# EAGLE design Winter_v2 (EAGLE 9.2.0)

## Sheet 1 of 4
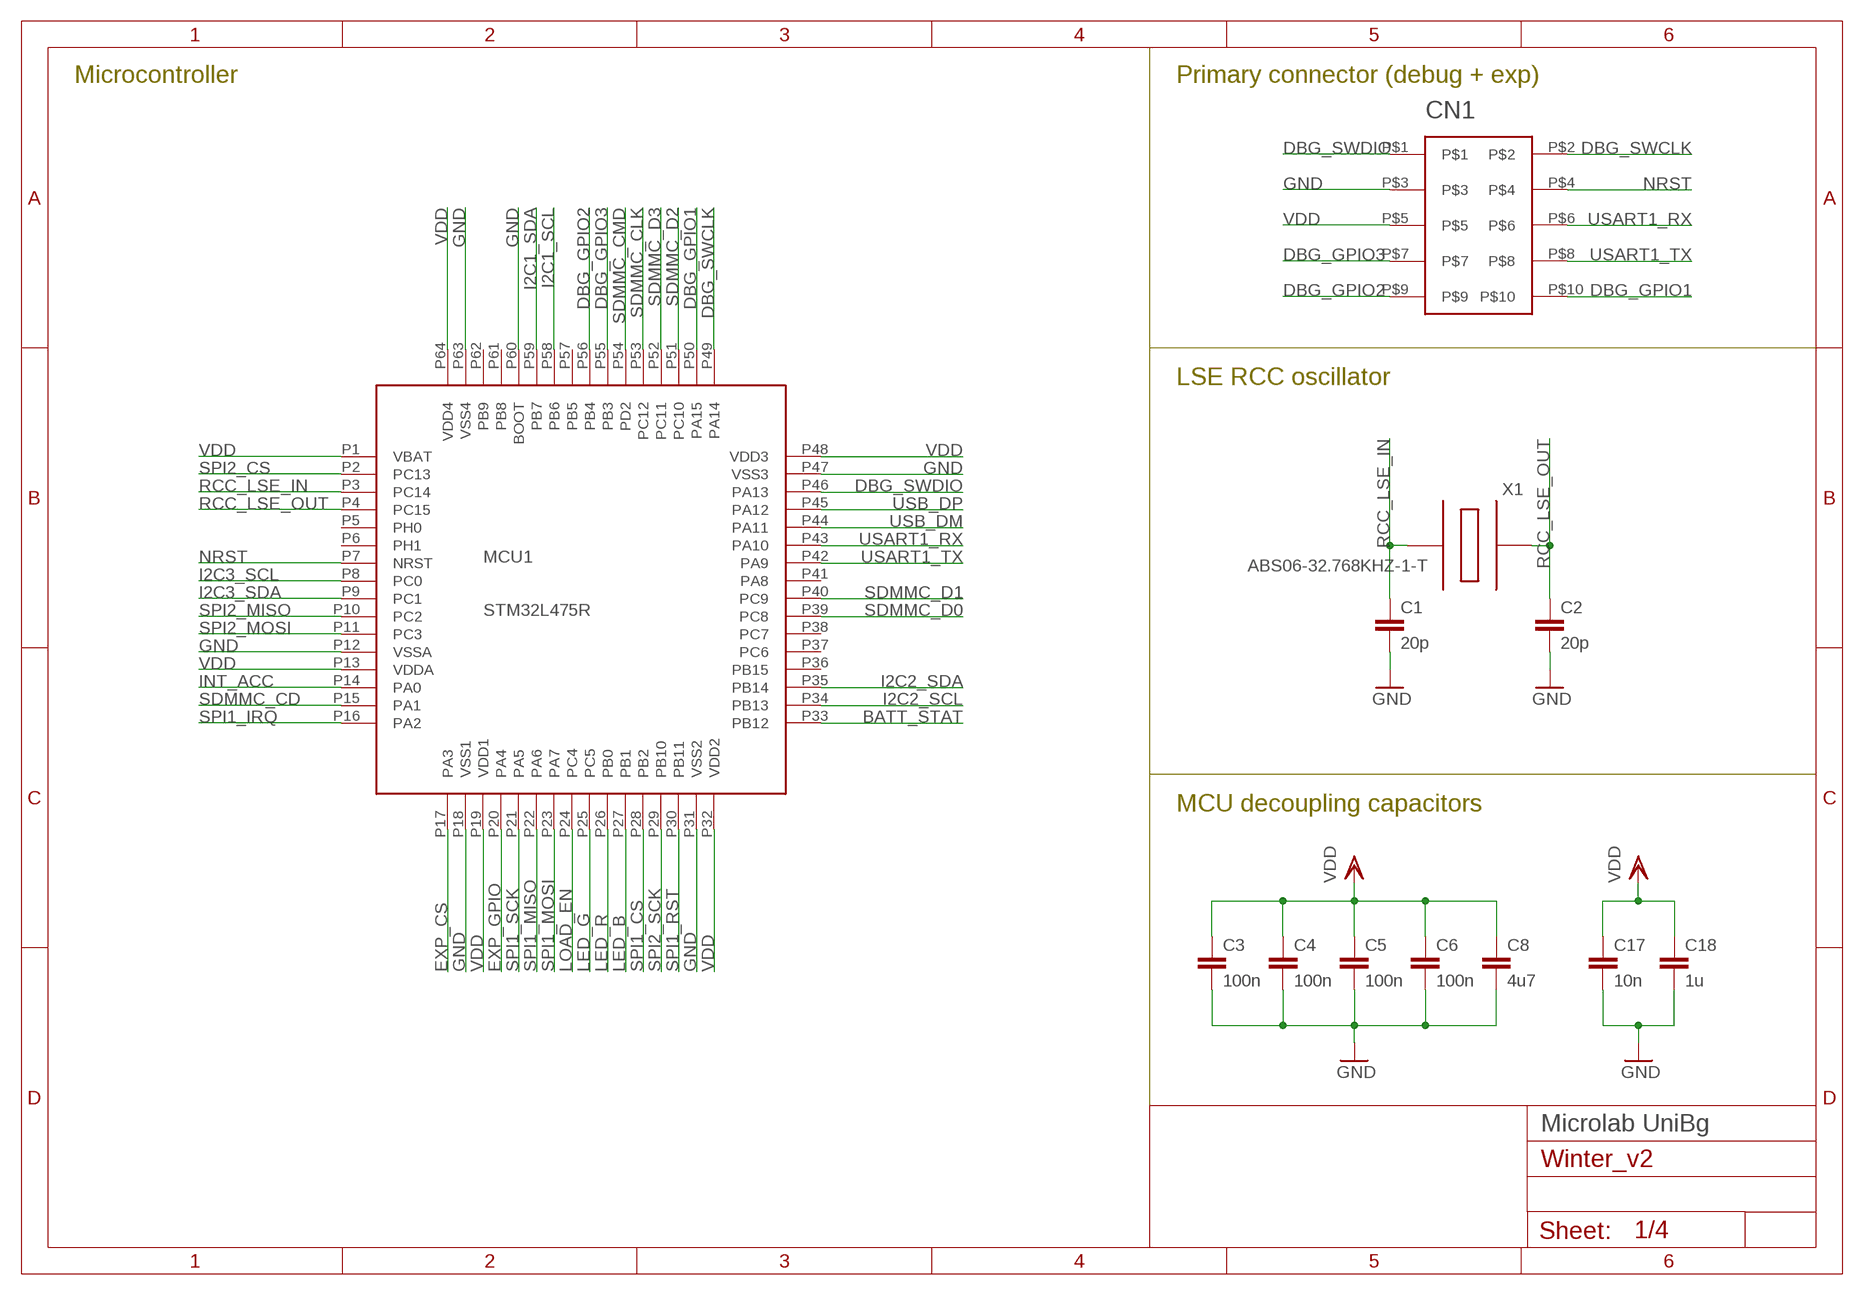
[diagram p0: schematic, sheet 1]

### Parts
C1  20p  C0402  [C0402]
C2  20p  C0402  [C0402]
C3  100n  C0402  [C0402]
C4  100n  C0402  [C0402]
C5  100n  C0402  [C0402]
C6  100n  C0402  [C0402]
C8  4u7  C0402  [C0402]
C17  10n  C0402  [C0402]
C18  1u  C0402  [C0402]
CN1  FTSH-105TO  [FTSH-105-XX]
MCU1  STM32L475R  [LQFP64]
X1  ABS06-32.768KHZ-1-T  [ABS06]

### Nets
BATT_STAT: MCU1.P33(PB12) ; also sheet 2
DBG_GPIO1: CN1.P$10 MCU1.P50(PA15)
DBG_GPIO2: CN1.P$9 MCU1.P56(PB4)
DBG_GPIO3: CN1.P$7 MCU1.P55(PB3)
DBG_SWCLK: CN1.P$2 MCU1.P49(PA14)
DBG_SWDIO: CN1.P$1 MCU1.P46(PA13)
EXP_CS: MCU1.P17(PA3) ; also sheet 4
EXP_GPIO: MCU1.P20(PA4) ; also sheet 4
GND: C1.P$2 C2.P$2 C3.P$2 C4.P$2 C5.P$2 C6.P$2 C8.P$2 C17.P$2 C18.P$2 CN1.P$3 MCU1.P12(VSSA) MCU1.P18(VSS1) MCU1.P31(VSS2) MCU1.P47(VSS3) MCU1.P60(BOOT) MCU1.P63(VSS4) ; also sheet 2,3,4
I2C1_SCL: MCU1.P58(PB6) ; also sheet 3
I2C1_SDA: MCU1.P59(PB7) ; also sheet 3
I2C2_SCL: MCU1.P34(PB13) ; also sheet 2
I2C2_SDA: MCU1.P35(PB14) ; also sheet 2
I2C3_SCL: MCU1.P8(PC0) ; also sheet 4
I2C3_SDA: MCU1.P9(PC1) ; also sheet 4
INT_ACC: MCU1.P14(PA0) ; also sheet 3
LED_B: MCU1.P27(PB1) ; also sheet 2
LED_G: MCU1.P25(PC5) ; also sheet 2
LED_R: MCU1.P26(PB0) ; also sheet 2
LOAD_EN: MCU1.P24(PC4) ; also sheet 2
NRST: CN1.P$4 MCU1.P7(NRST)
RCC_LSE_IN: C1.P$1 MCU1.P3(PC14) X1.P1
RCC_LSE_OUT: C2.P$1 MCU1.P4(PC15) X1.P2
SDMMC_CD: MCU1.P15(PA1) ; also sheet 4
SDMMC_CLK: MCU1.P53(PC12) ; also sheet 4
SDMMC_CMD: MCU1.P54(PD2) ; also sheet 4
SDMMC_D0: MCU1.P39(PC8) ; also sheet 4
SDMMC_D1: MCU1.P40(PC9) ; also sheet 4
SDMMC_D2: MCU1.P51(PC10) ; also sheet 4
SDMMC_D3: MCU1.P52(PC11) ; also sheet 4
SPI1_CS: MCU1.P28(PB2) ; also sheet 4
SPI1_IRQ: MCU1.P16(PA2) ; also sheet 4
SPI1_MISO: MCU1.P22(PA6) ; also sheet 4
SPI1_MOSI: MCU1.P23(PA7) ; also sheet 4
SPI1_RST: MCU1.P30(PB11) ; also sheet 4
SPI1_SCK: MCU1.P21(PA5) ; also sheet 4
SPI2_CS: MCU1.P2(PC13) ; also sheet 3
SPI2_MISO: MCU1.P10(PC2) ; also sheet 3,4
SPI2_MOSI: MCU1.P11(PC3) ; also sheet 3,4
SPI2_SCK: MCU1.P29(PB10) ; also sheet 3,4
USART1_RX: CN1.P$6 MCU1.P43(PA10)
USART1_TX: CN1.P$8 MCU1.P42(PA9)
USB_DM: MCU1.P44(PA11) ; also sheet 4
USB_DP: MCU1.P45(PA12) ; also sheet 4
VDD: C3.P$1 C4.P$1 C5.P$1 C6.P$1 C8.P$1 C17.P$1 C18.P$1 CN1.P$5 MCU1.P1(VBAT) MCU1.P13(VDDA) MCU1.P19(VDD1) MCU1.P32(VDD2) MCU1.P48(VDD3) MCU1.P64(VDD4) ; also sheet 2,3,4
Unconnected: MCU1.P5(PH0) MCU1.P6(PH1) MCU1.P36(PB15) MCU1.P37(PC6) MCU1.P38(PC7) MCU1.P41(PA8) MCU1.P57(PB5) MCU1.P61(PB8) MCU1.P62(PB9)

### Notes on the sheet
- Microcontroller | Primary connector (debug + exp)
- LSE RCC oscillator
- MCU decoupling capacitors
- Microlab UniBg

## Sheet 2 of 4
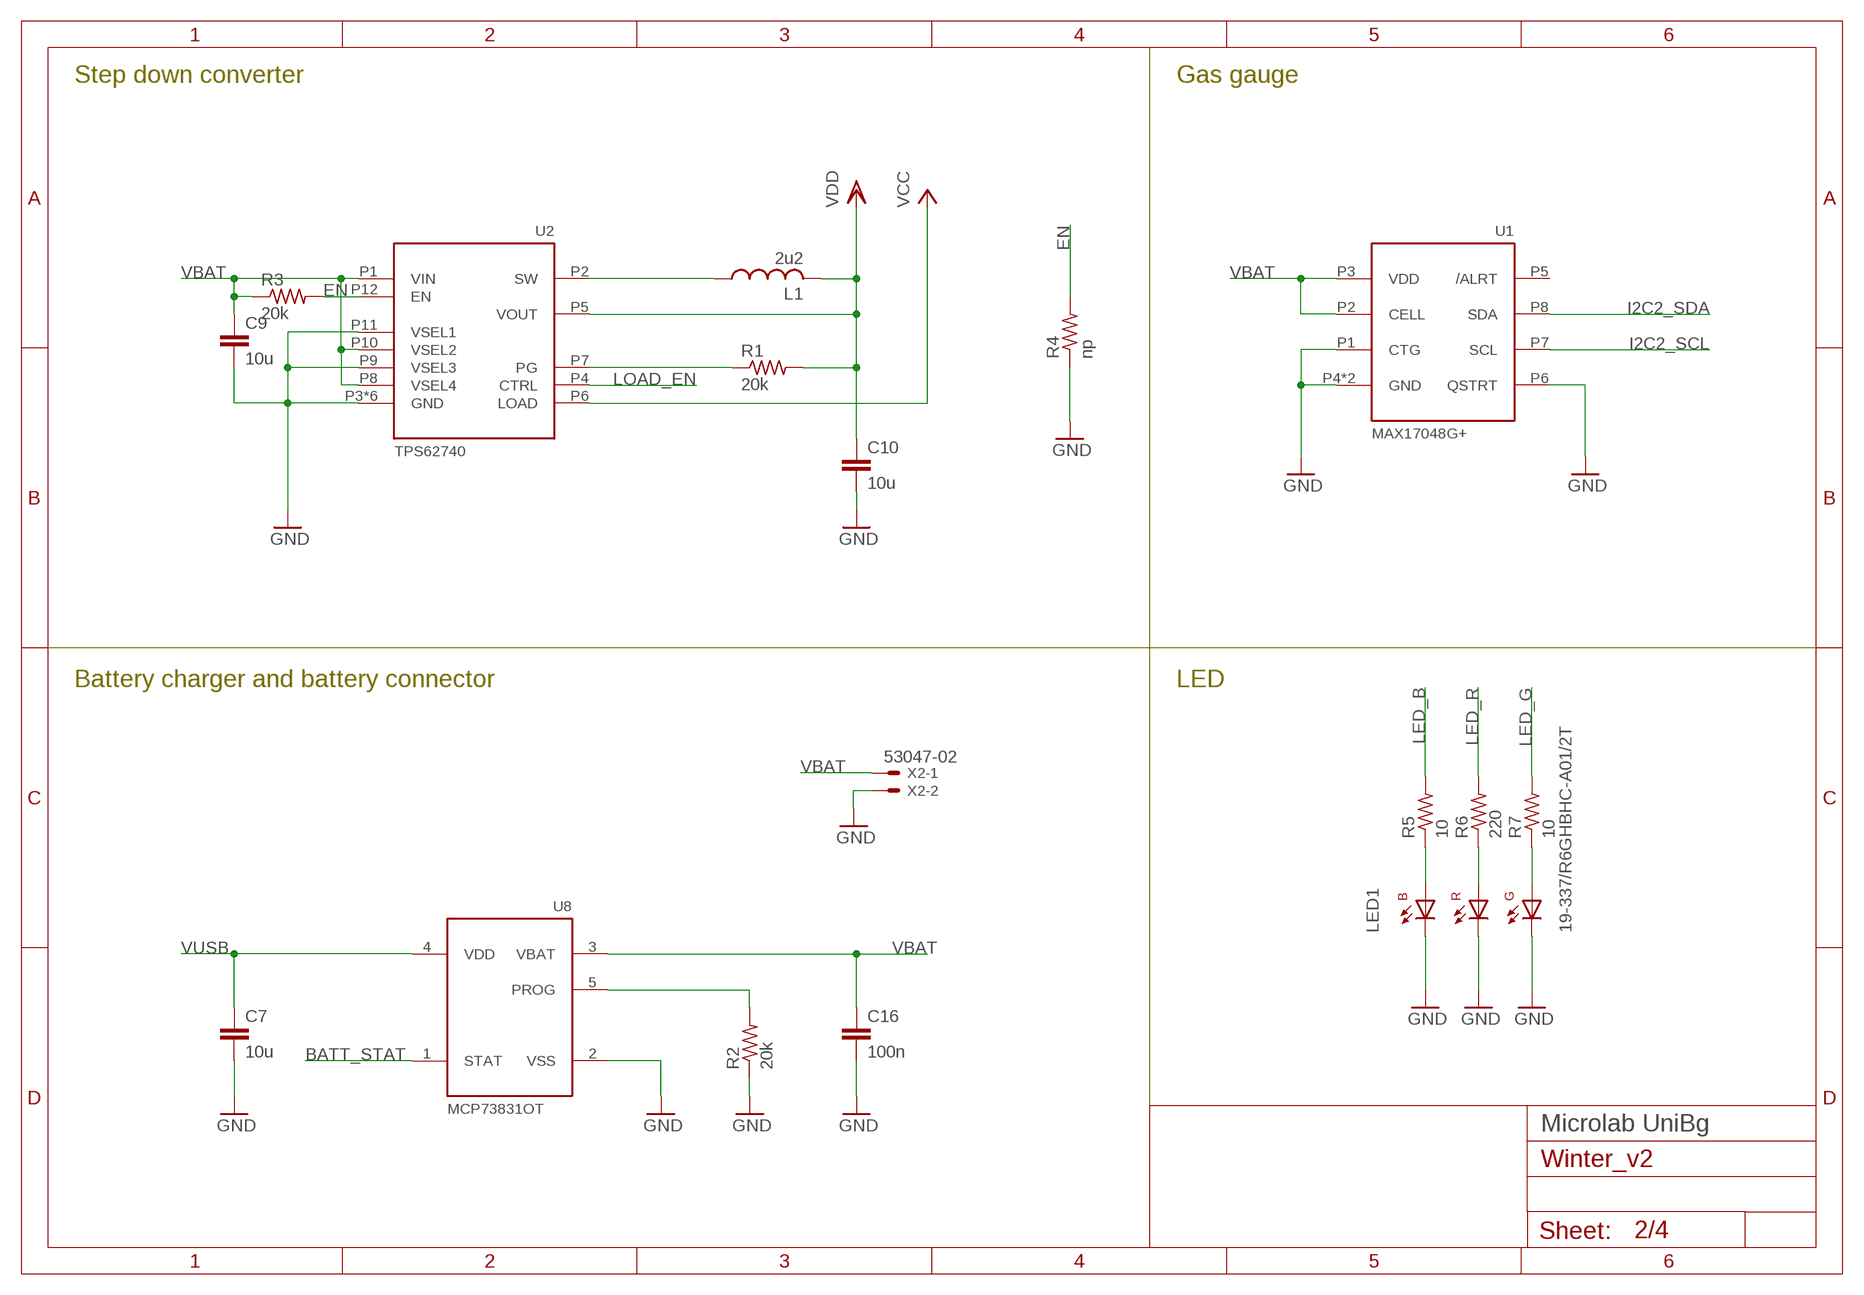
[diagram p1: schematic, sheet 2]

### Parts
C7  10u  C0603  [C0603]
C9  10u  C0603  [C0603]
C10  10u  C0603  [C0603]
C16  100n  C0402  [C0402]
L1  2u2  74479276222C74479276222C  [C01005]
LED1  19-337/R6GHBHC-A01/2T  [19-337/R6GHBHC-A01/2T]
R1  20k  R0402  [0402]
R2  20k  R0402  [0402]
R3  20k  R0402  [0402]
R4  np  R0402  [0402]
R5  10  R0402  [0402]
R6  220  R0402  [0402]
R7  10  R0402  [0402]
U1  MAX17048G+  [TDFN8-2X2]
U2  TPS62740  [R-PWSON-N12]
U8  MCP73831OT  [SOT23-5L]
X2  53047-02  [53047-02]

### Nets
BATT_STAT: U8.1(STAT) ; also sheet 1
EN: R3.P$2 R4.P$2 U2.P12(EN)
GND: C7.P$2 C9.P$2 C10.P$2 C16.P$2 LED1.P$1(CB) LED1.P$2(CR) LED1.P$3(CG) R2.P$1 R4.P$1 U1.P1(CTG) U1.P4(GND) U1.P6(QSTRT) U1.P9(GND) U2.P3(GND) U2.P9(VSEL3) U2.P11(VSEL1) U2.PG1(GND) U2.PG2(GND) U2.PG3(GND) U2.PG4(GND) U2.PG5(GND) U8.2(VSS) X2.2 ; also sheet 1,3,4
I2C2_SCL: U1.P7(SCL) ; also sheet 1
I2C2_SDA: U1.P8(SDA) ; also sheet 1
LED_B: R5.P$2 ; also sheet 1
LED_G: R7.P$2 ; also sheet 1
LED_R: R6.P$2 ; also sheet 1
LOAD_EN: U2.P4(CTRL) ; also sheet 1
N$1: L1.P$1 U2.P2(SW)
N$2: R1.P$1 U2.P7(PG)
N$3: LED1.P$4(AB) R5.P$1
N$4: LED1.P$5(AR) R6.P$1
N$5: LED1.P$6(AG) R7.P$1
N$6: R2.P$2 U8.5(PROG)
VBAT: C9.P$1 C16.P$1 R3.P$1 U1.P2(CELL) U1.P3(VDD) U2.P1(VIN) U2.P8(VSEL4) U2.P10(VSEL2) U8.3(VBAT) X2.1 ; also sheet 4
VCC: U2.P6(LOAD) ; also sheet 4
VDD: C10.P$1 L1.P$2 R1.P$2 U2.P5(VOUT) ; also sheet 1,3,4
VUSB: C7.P$1 U8.4(VDD) ; also sheet 4
Unconnected: U1.P5(/ALRT)

### Notes on the sheet
- Step down converter | Gas gauge
- Battery charger and battery connector | LED
- Microlab UniBg

## Sheet 3 of 4
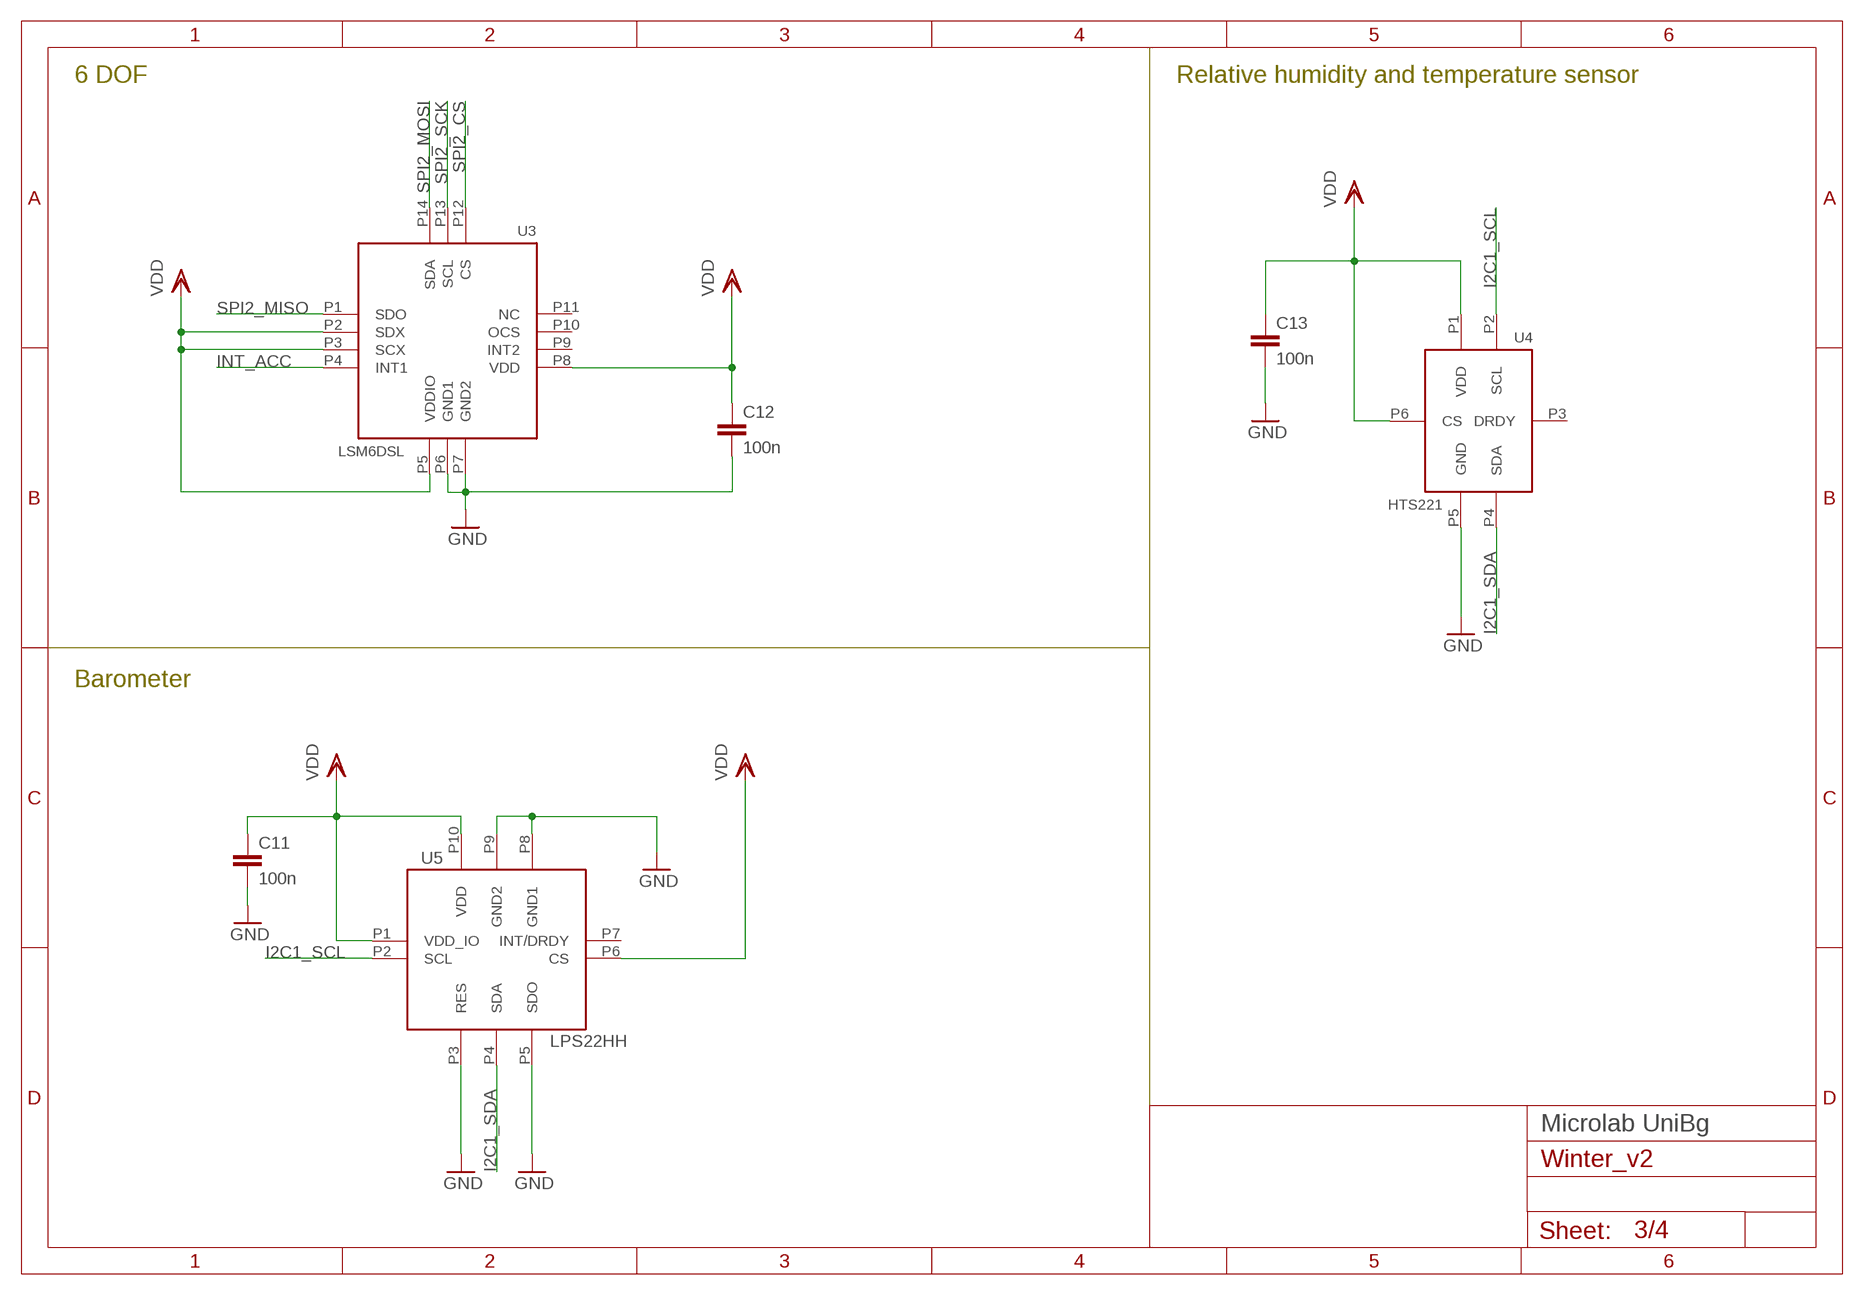
[diagram p2: schematic, sheet 3]

### Parts
C11  100n  C0402  [C0402]
C12  100n  C0402  [C0402]
C13  100n  C0402  [C0402]
U3  LSM6DSL  [LGA-14L]
U4  HTS221  [HCLGA-6L]
U5  LPS22HH  [HLGA-10L]

### Nets
GND: C11.P$2 C12.P$2 C13.P$2 U3.P6(GND1) U3.P7(GND2) U4.P5(GND) U5.P3(RES) U5.P5(SDO) U5.P8(GND1) U5.P9(GND2) ; also sheet 1,2,4
I2C1_SCL: U4.P2(SCL) U5.P2(SCL) ; also sheet 1
I2C1_SDA: U4.P4(SDA) U5.P4(SDA) ; also sheet 1
INT_ACC: U3.P4(INT1) ; also sheet 1
SPI2_CS: U3.P12(CS) ; also sheet 1
SPI2_MISO: U3.P1(SDO) ; also sheet 1,4
SPI2_MOSI: U3.P14(SDA) ; also sheet 1,4
SPI2_SCK: U3.P13(SCL) ; also sheet 1,4
VDD: C11.P$1 C12.P$1 C13.P$1 U3.P2(SDX) U3.P3(SCX) U3.P5(VDDIO) U3.P8(VDD) U4.P1(VDD) U4.P6(CS) U5.P1(VDD_IO) U5.P6(CS) U5.P10(VDD) ; also sheet 1,2,4
Unconnected: U3.P9(INT2) U3.P10(OCS) U3.P11(NC) U4.P3(DRDY) U5.P7(INT/DRDY)

### Notes on the sheet
- 6 DOF | Relative humidity and temperature sensor
- Barometer
- Microlab UniBg

## Sheet 4 of 4
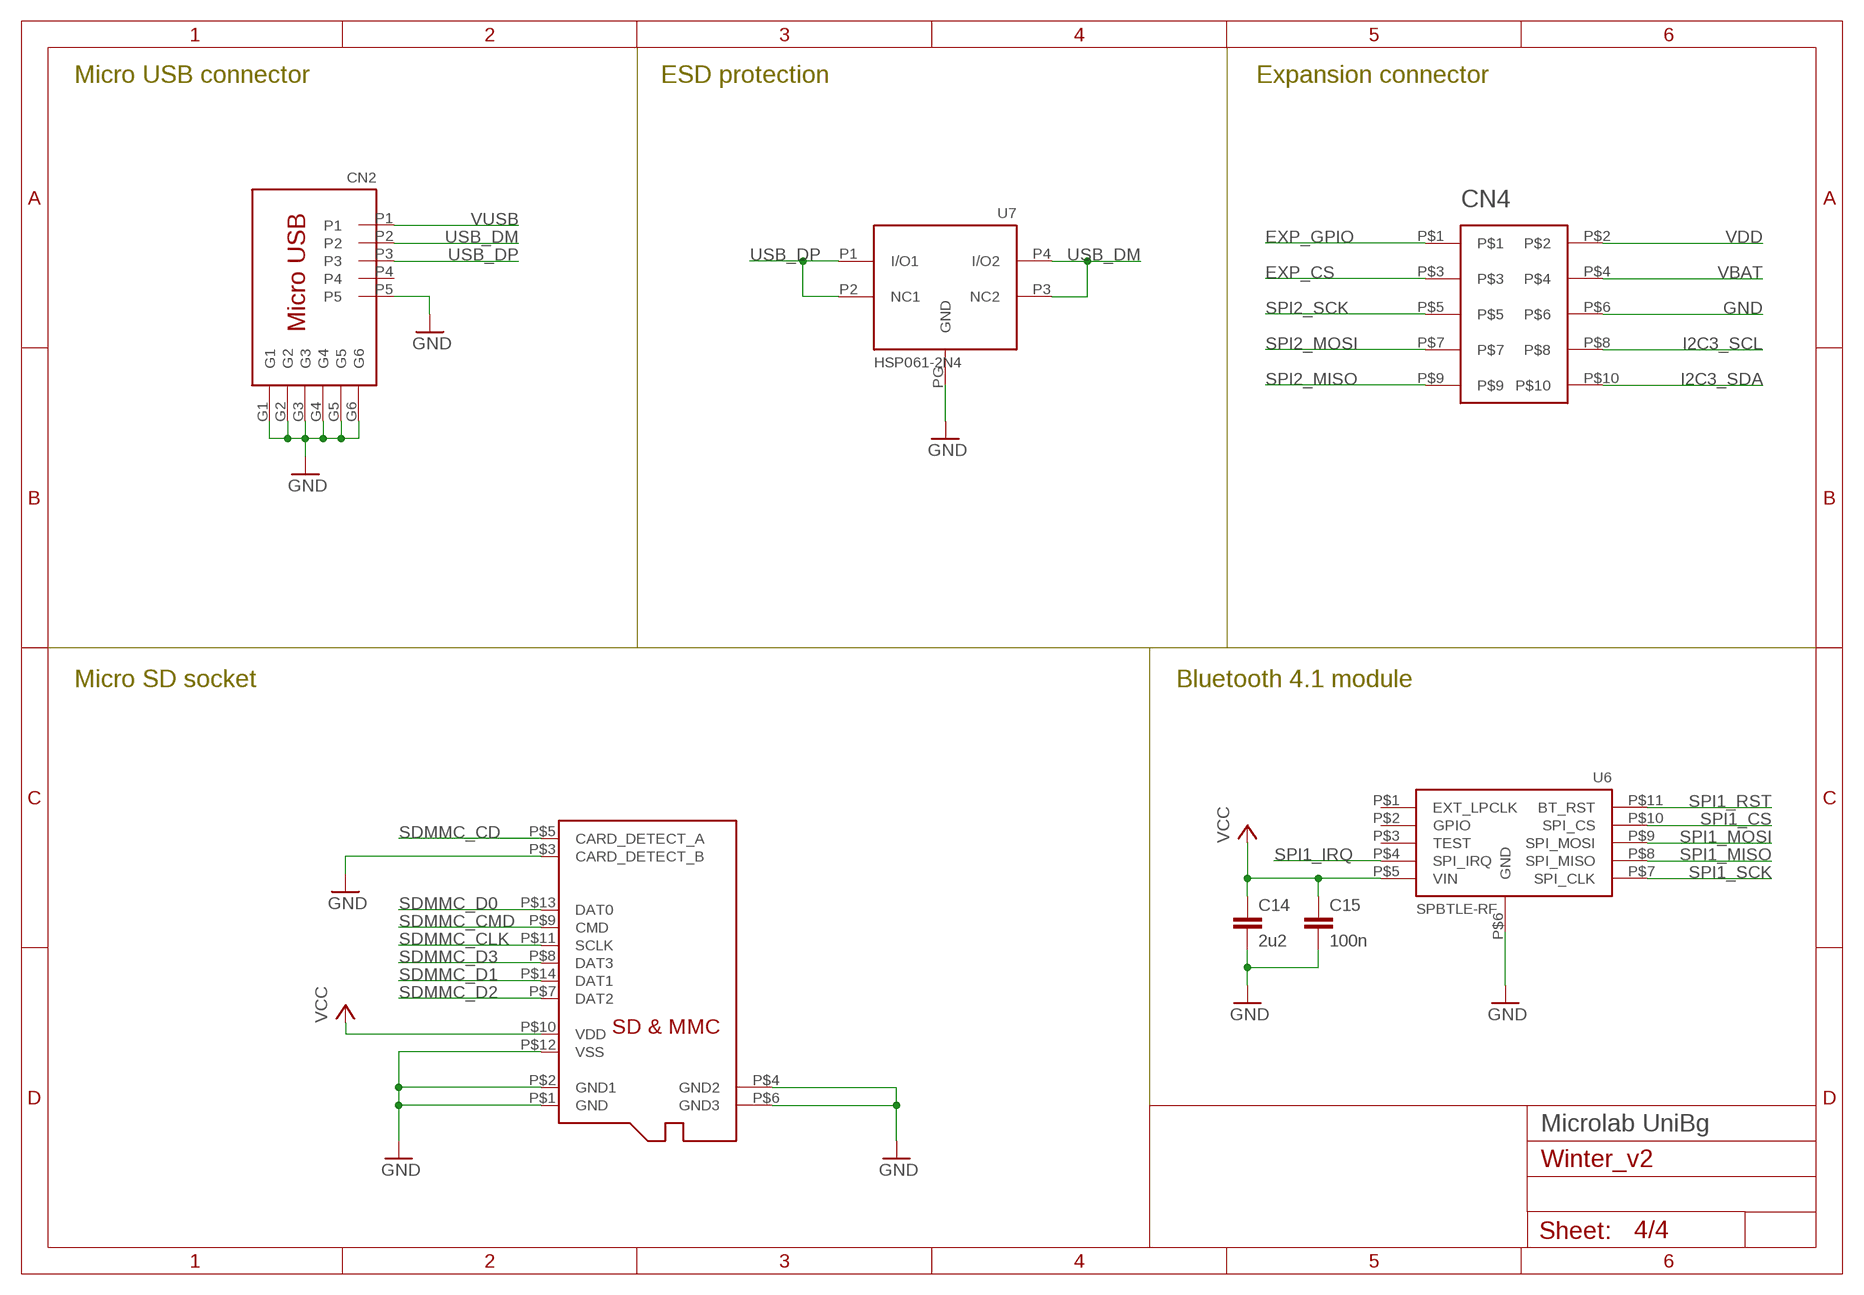
[diagram p3: schematic, sheet 4]

### Parts
C14  2u2  C0402  [C0402]
C15  100n  C0402  [C0402]
CN2  USB3075  [USB3075]
CN3  MICRO_SD-5025700893  [5025700893]
CN4  FTSH-105TO  [FTSH-105-XX]
U6  SPBTLE-RF  [SPBTLE-RF]
U7  HSP061-2N4  [μQFN-4L]

### Nets
EXP_CS: CN4.P$3 ; also sheet 1
EXP_GPIO: CN4.P$1 ; also sheet 1
GND: C14.P$2 C15.P$2 CN2.G1 CN2.G2 CN2.G3 CN2.G4 CN2.G5 CN2.G6 CN2.P5 CN3.P$1(GND) CN3.P$2(GND1) CN3.P$3(CARD_DETECT_B) CN3.P$4(GND2) CN3.P$6(GND3) CN3.P$12(VSS) CN4.P$6 U6.P$6(GND) U7.PG(GND) ; also sheet 1,2,3
I2C3_SCL: CN4.P$8 ; also sheet 1
I2C3_SDA: CN4.P$10 ; also sheet 1
SDMMC_CD: CN3.P$5(CARD_DETECT_A) ; also sheet 1
SDMMC_CLK: CN3.P$11(SCLK) ; also sheet 1
SDMMC_CMD: CN3.P$9(CMD) ; also sheet 1
SDMMC_D0: CN3.P$13(DAT0) ; also sheet 1
SDMMC_D1: CN3.P$14(DAT1) ; also sheet 1
SDMMC_D2: CN3.P$7(DAT2) ; also sheet 1
SDMMC_D3: CN3.P$8(DAT3) ; also sheet 1
SPI1_CS: U6.P$10(SPI_CS) ; also sheet 1
SPI1_IRQ: U6.P$4(SPI_IRQ) ; also sheet 1
SPI1_MISO: U6.P$8(SPI_MISO) ; also sheet 1
SPI1_MOSI: U6.P$9(SPI_MOSI) ; also sheet 1
SPI1_RST: U6.P$11(BT_RST) ; also sheet 1
SPI1_SCK: U6.P$7(SPI_CLK) ; also sheet 1
SPI2_MISO: CN4.P$9 ; also sheet 1,3
SPI2_MOSI: CN4.P$7 ; also sheet 1,3
SPI2_SCK: CN4.P$5 ; also sheet 1,3
USB_DM: CN2.P2 U7.P3(NC2) U7.P4(I/O2) ; also sheet 1
USB_DP: CN2.P3 U7.P1(I/O1) U7.P2(NC1) ; also sheet 1
VBAT: CN4.P$4 ; also sheet 2
VCC: C14.P$1 C15.P$1 CN3.P$10(VDD) U6.P$5(VIN) ; also sheet 2
VDD: CN4.P$2 ; also sheet 1,2,3
VUSB: CN2.P1 ; also sheet 2
Unconnected: CN2.P4 U6.P$1(EXT_LPCLK) U6.P$2(GPIO) U6.P$3(TEST)

### Notes on the sheet
- Micro USB connector | ESD protection | Expansion connector
- Micro SD socket | Bluetooth 4.1 module
- Microlab UniBg

## Library data of the parts
C1-C18 = 221e_passives:C
CN1 CN4 = Microlab_Andrea:FTSH-105
CN2 = Microlab_Andrea:USB3075: GLOBAL CONNECTOR TECHNOLOGY USB3075-30-A MICRO USB 2.0 B CONNECTOR, 5POS, SMT RT ANGLE
CN3 = Microlab_Pat:MICRO_SD-5025700893
L1 = Microlab_Andrea:74479276222C
LED1 = Microlab_Andrea:19-337/R6GHBHC-A01/2T
MCU1 = Microlab_Andrea:STM32L475: STMicroelectronics STM32L475R Ultra-low-power Arm® Cortex®-M4 32-bit MCU+FPU, 100DMIPS, up to 1MB Flash, 128 KB SRAM, USB OTG FS, analog, audio
R1-R7 = 221e_passives:R
U1 = Microlab_Andrea:MAX17048: Maxim Integrated MAX17048 Micropower 1-Cell/2-Cell Li+ ModelGauge ICs
U2 = Microlab_Andrea:TPS62740: STMicroelectronics TPS62740 360nA IQ Step Down Converter For Low Power Applications
U3 = Microlab_Andrea:LSM6DSL: <STMicroelectronics> LSM6DS3 or LSM6DSM iNEMO inertial module: Always-on 3D accelerometer and 3D gyroscope
U4 = Microlab_Andrea:HTS221: STMicroelectronics HTS221 Capacitive digital sensor for relative humidity and temperature
U5 = Microlab_Andrea:LPS22HH: STMicroelectronics LPS22HH
U6 = Microlab_Andrea:SPBTLE-RF
U7 = Microlab_Andrea:HSP061-2: HSP061-2 2-line ESD protection for high speed lines.
U8 = Microlab_Andrea:MCP73831: Microchip MCP73831T Miniature Single-Cell, Fully Integrated Li-Ion, Li-Polymer Charge Management Controllers
X1 = Microlab_Andrea:ABS06-32.768KHZ-1-T: Abracon ABS06-32.768KHZ-1-T
X2 = Microlab_Gal:53?-02: CONNECTOR wire to board 1.25 mm (.049 inch) pitch header; MF: MOLEX; MPN: 53047-0210; OC_FARNELL: 9733051; OC_NEWARK: 57H4701

## Board
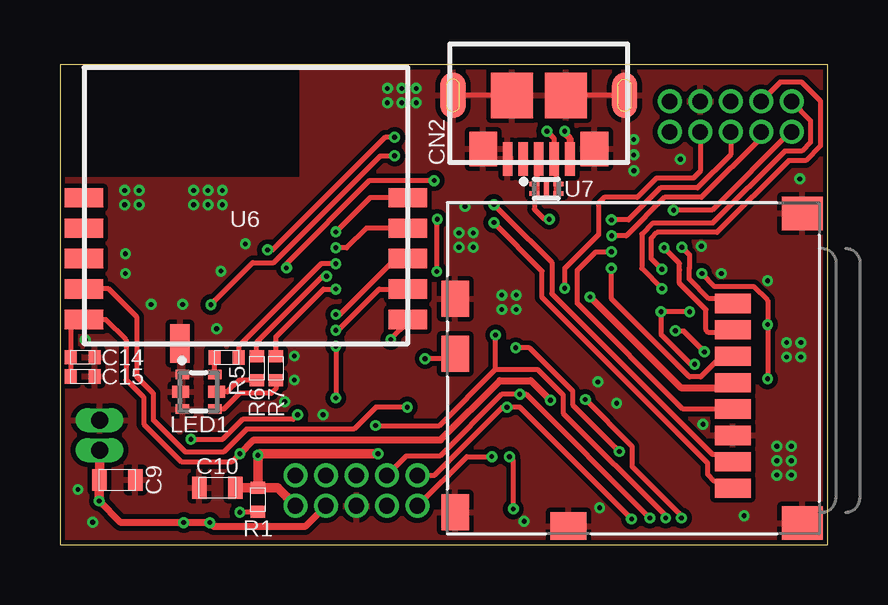
[diagram p4: board, top side]
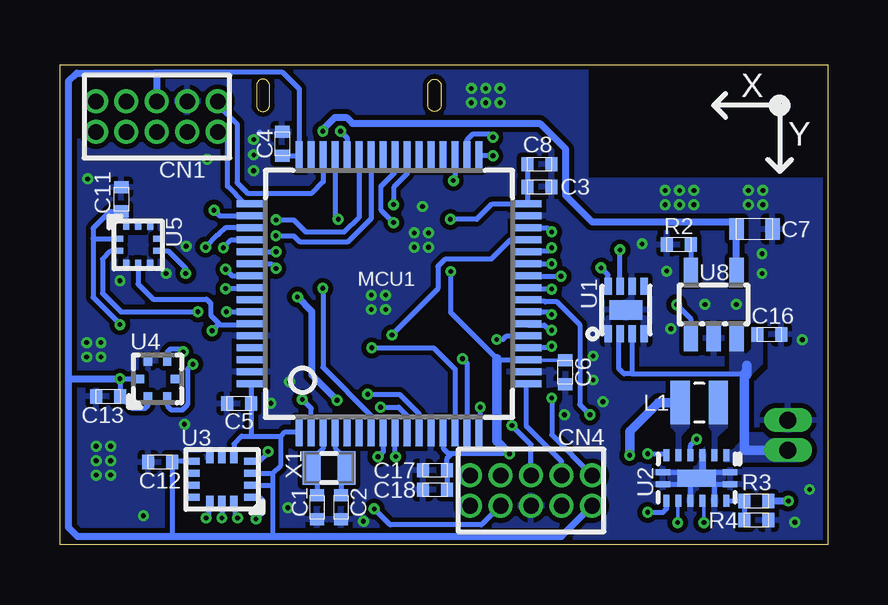
[diagram p5: board, bottom side, seen from below]

Size 32 x 20 mm. Coordinates in mm from the lower left corner, seen from the top.
Outline: 0,0 32,0 32,20 0,20 0,0
Copper layers (1*16): Top 0.035mm / dielectric 1.2mm / Bottom 0.035mm
Design rules "stackup_2layer *": minimum track width 0.1mm, minimum drill 0.2mm, track to track 0.2mm, track to pad 0.2mm, pad to pad 0.2mm, via to via 0.2mm, smd to smd 0.2mm, copper to edge 0.2mm, drill to drill 5mil, minimum pad ring 0.15mm, minimum via ring 5mil, stop-mask expansion 0.035mm, vias tented up to drill 0.5mm, thermal gap 0.2mm
bRestrict: 8 lines

### Footprints (pad centres in the part's own frame; a part is rotated, then mirrored left to right if it is on the bottom)
C0402 = smd 0.5 x 0.6: P$1 -0.5,0; P$2 0.5,0
C0603 = smd 0.6 x 0.9: P$1 -0.75,0; P$2 0.75,0
FTSH-105-XX = drill 0.65 pad 1: P$1 0.5,1.07; P$2 0.5,2.34; P$3 1.77,1.07; P$4 1.77,2.34; P$5 3.04,1.07; P$6 3.04,2.34; P$7 4.31,1.07; P$8 4.31,2.34; P$9 5.58,1.07; P$10 5.58,2.34
USB3075 = smd 1.15 x 1.45: G1 -2.32,2.23; G6 2.32,2.23 | smd 1.05 x 1.9: G2 -3.575,0; G5 3.575,0 | smd 1.75 x 1.9: G3 -1.125,0; G4 1.125,0 | smd 0.4 x 1.4: P1 -1.3,2.65; P2 -0.65,2.65; P3 0,2.65; P4 0.65,2.65; P5 1.3,2.65
5025700893 = smd 1.4 x 1.7: P$1 0.7,-0.85; P$2 13.6,-0.85 | smd 1.15 x 1.5: P$3 13.725,-10.6 | smd 1.5 x 1.15: P$4 13.15,-15.325; P$5 6.55,-15.325; P$6 4.25,-15.325 | smd 0.8 x 1.5: P$7 4.45,-3.75; P$8 5.55,-3.75; P$9 6.65,-3.75; P$10 7.75,-3.75; P$11 8.85,-3.75; P$12 9.95,-3.75; P$13 11.05,-3.75; P$14 12.15,-3.75
C01005 = smd 0.8 x 1.8: P$1 -0.8,0; P$2 0.8,0
19-337/R6GHBHC-A01/2T = smd 0.55 x 0.4: P$1 -0.675,0.725; P$3 -0.675,-0.725; P$4 0.675,0.725; P$6 0.675,-0.725 | smd 0.7 x 0.5: P$2 -0.75,0; P$5 0.75,0
LQFP64 = smd 1.2 x 0.3: P1 -5.75,3.75; P2 -5.75,3.25; P3 -5.75,2.75; P4 -5.75,2.25; P5 -5.75,1.75; P6 -5.75,1.25; P7 -5.75,0.75; P8 -5.75,0.25; P9 -5.75,-0.25; P10 -5.75,-0.75; P11 -5.75,-1.25; P12 -5.75,-1.75; P13 -5.75,-2.25; P14 -5.75,-2.75; P15 -5.75,-3.25; P16 -5.75,-3.75; P33 5.75,-3.75; P34 5.75,-3.25; P35 5.75,-2.75; P36 5.75,-2.25; P37 5.75,-1.75; P38 5.75,-1.25; P39 5.75,-0.75; P40 5.75,-0.25; P41 5.75,0.25; P42 5.75,0.75; P43 5.75,1.25; P44 5.75,1.75; P45 5.75,2.25; P46 5.75,2.75; P47 5.75,3.25; P48 5.75,3.75 | smd 0.3 x 1.2: P17 -3.75,-5.75; P18 -3.25,-5.75; P19 -2.75,-5.75; P20 -2.25,-5.75; P21 -1.75,-5.75; P22 -1.25,-5.75; P23 -0.75,-5.75; P24 -0.25,-5.75; P25 0.25,-5.75; P26 0.75,-5.75; P27 1.25,-5.75; P28 1.75,-5.75; P29 2.25,-5.75; P30 2.75,-5.75; P31 3.25,-5.75; P32 3.75,-5.75; P49 3.75,5.75; P50 3.25,5.75; P51 2.75,5.75; P52 2.25,5.75; P53 1.75,5.75; P54 1.25,5.75; P55 0.75,5.75; P56 0.25,5.75; P57 -0.25,5.75; P58 -0.75,5.75; P59 -1.25,5.75; P60 -1.75,5.75; P61 -2.25,5.75; P62 -2.75,5.75; P63 -3.25,5.75; P64 -3.75,5.75
0402 = smd 0.5 x 0.6: P$1 -0.5,0; P$2 0.5,0
TDFN8-2X2 = smd 0.7 x 0.3: P1 -0.99,0.75; P2 -0.99,0.25; P3 -0.99,-0.25; P4 -0.99,-0.75; P5 0.99,-0.75; P6 0.99,-0.25; P7 0.99,0.25; P8 0.99,0.75 | smd 0.8 x 1.38: P9 0,0
R-PWSON-N12 = smd 0.25 x 0.5: P1 -1.25,-0.95; P2 -0.75,-0.95; P3 -0.25,-0.95; P4 0.25,-0.95; P5 0.75,-0.95; P6 1.25,-0.95; P7 1.25,0.95; P8 0.75,0.95; P9 0.25,0.95; P10 -0.25,0.95; P11 -0.75,0.95; P12 -1.25,0.95 | smd 0.6 x 0.25: PG1 -1.4,0.25; PG2 -1.4,-0.25; PG4 1.4,-0.25; PG5 1.4,0.25 | smd 1.6 x 0.7: PG3 0,0
LGA-14L = smd 0.5 x 0.3: P1 -1.175,0.75; P2 -1.175,0.25; P3 -1.175,-0.25; P4 -1.175,-0.75; P8 1.175,-0.75; P9 1.175,-0.25; P10 1.175,0.25; P11 1.175,0.75 | smd 0.3 x 0.5: P5 -0.5,-0.925; P6 0,-0.925; P7 0.5,-0.925; P12 0.5,0.925; P13 0,0.925; P14 -0.5,0.925
HCLGA-6L = smd 0.4 x 0.35: P1 -0.75,0.4; P2 -0.75,-0.4; P4 0.75,-0.4; P5 0.75,0.4 | smd 0.35 x 0.4: P3 0,-0.75; P6 0,0.75
HLGA-10L = smd 0.275 x 0.25: P1 -0.762,0.25; P2 -0.762,-0.25; P6 0.762,-0.25; P7 0.762,0.25 | smd 0.25 x 0.275: P3 -0.5,-0.762; P4 0,-0.762; P5 0.5,-0.762; P8 0.5,0.762; P9 0,0.762; P10 -0.5,0.762
SPBTLE-RF = smd 1.6 x 0.8: P$1 -6.75,0.33; P$2 -6.75,-0.94; P$3 -6.75,-2.21; P$4 -6.75,-3.48; P$5 -6.75,-4.75; P$7 6.75,-4.75; P$8 6.75,-3.48; P$9 6.75,-2.21; P$10 6.75,-0.94; P$11 6.75,0.33 | smd 0.8 x 1.6: P$6 -2.75,-5.75
μQFN-4L = smd 0.2 x 0.4: P1 0.2,0.5; P2 -0.2,0.5; P3 -0.2,-0.5; P4 0.2,-0.5 | smd 0.68 x 0.2: PG 0,0
SOT23-5L = smd 0.6 x 1.1: 1 -0.95,-1.4; 2 0,-1.4; 3 0.95,-1.4; 4 0.95,1.4; 5 -0.95,1.4
ABS06 = smd 0.75 x 1.4: P1 -0.725,0; P2 0.725,0
53047-02 = drill 0.71 pad 0.8 long: 1 0.625,0.45; 2 -0.625,0.45

### Placement (x,y rotation side)
C1  21.28,1.55 270 bottom
C2  20.28,1.55 270 bottom
C3  12.01,14.91 0 bottom
C4  22.73,16.7 90 bottom
C5  24.53,5.88 180 bottom
C6  10.93,7.19 270 bottom
C7  3.05,13.15 0 bottom
C8  12.01,15.85 0 bottom
C9  2.39,2.7 0 top
C10  6.56,2.37 180 top
C11  29.44,14.39 90 bottom
C12  27.82,3.44 180 bottom
C13  30,6.18 180 bottom
C14  0.95,7.81 0 top
C15  0.95,7.01 0 top
C16  2.43,8.76 0 bottom
C17  16.36,3.1 180 bottom
C18  16.36,2.29 180 bottom
CN1  24.92,19.54 180 bottom
CN2  19.96,18.72 180 top
CN3  31.8,14.5 270 top
CN4  9.32,3.96 180 bottom
DRILEGEND  [DRILEGEND]  -7.13,-3.92 0 top  (outside the outline)
L1  5.35,5.92 180 bottom
LED1  5.78,6.37 0 top
MCU1  18.28,10.45 90 bottom
R1  8.25,1.87 90 top
R2  6.2,12.5 0 bottom
R3  2.96,1.82 180 bottom
R4  2.96,1.02 180 bottom
R5  6.95,7.8 0 top
R6  8.2,7.35 90 top
R7  9,7.35 90 top
U1  8.4,9.78 90 bottom
U2  5.46,2.77 180 bottom
U3  25.25,2.72 180 bottom
U4  27.93,6.91 90 bottom
U5  28.75,12.49 0 bottom
U6  7.75,14.13 0 top
U7  20.28,14.83 90 top
U8  4.75,10.01 0 bottom
X1  20.78,3.2 0 bottom
X2  1.2,4.56 270 top

### Tracks (layer width: path | path; a pad name or v marks a point on that pad's centre or on a via)
BATT_STAT  (via drill 0.2 pad 0.45)
  Top 0.2: v6.29,10 8.04,11.75 8.91,11.75 13.36,16.2 v13.95,16.2
  Bottom 0.2: v6.29,10 5.7,9.41 U8.1 | MCU1.P33 v13.95,16.2
DBG_GPIO1  (via drill 0.2 pad 0.45)
  Top 0.2: v25.58,13.94 27.19,13.94 30.45,17.2 CN1.P$10
  Bottom 0.2: MCU1.P50 25.34,13.7 v25.58,13.94
DBG_GPIO2  (via drill 0.2 pad 0.45)
  Top 0.2: v25.09,10.67 24.25,11.51 24.25,12.94 24.73,13.41 27.23,13.41 30.22,16.4 30.92,16.4 31.3,16.78 31.3,17.67 CN1.P$9
  Bottom 0.2: MCU1.P56 24.06,10.67 v25.09,10.67
DBG_GPIO3  (via drill 0.2 pad 0.45)
  Top 0.2: CN1.P$7 30.03,19.27 30.92,19.27 31.7,18.49 31.7,16.61 31.09,16 30.38,16 27.39,13.01 24.89,13.01 24.65,12.77 24.65,11.91 v25.09,11.47
  Bottom 0.2: v25.09,11.47 24.82,11.2 MCU1.P55
DBG_SWCLK
  Bottom 0.2: MCU1.P49 24.08,14.25 24.35,14.25 25.02,14.92 25.02,16.8 CN1.P$2
DBG_SWDIO
  Bottom 0.2: MCU1.P46 21.03,15.12 21.5,14.65 24.18,14.65 24.62,15.09 24.62,17.54 25.42,18.34 CN1.P$1
EN
  Bottom 0.2: U2.P12 R3.P$2 R4.P$2
EXP_CS
  Bottom 0.2: CN4.P$3 11.09,3.47 12.55,4.93 12.55,6.68 MCU1.P17
EXP_GPIO  (via drill 0.2 pad 0.45)
  Top 0.2: v11.5,8.27 v11.5,6.11
  Bottom 0.2: v11.5,6.11 11.5,4.57 CN4.P$1 | v11.5,8.27 11.57,8.2 MCU1.P20
GND  (via drill 0.2 pad 0.45)
  Top 0.2: CN2.G4 CN2.G5 | CN2.G2 CN2.G3
  Bottom 0.152: 5.71,3.02 U2.PG3 | U2.PG3 5.51,2.72 5.71,2.72 U2.PG3 | U2.PG3 5.21,3.02
  Bottom 0.2: 5.21,3.02 U2.PG2 | 5.71,2.45 U2.P9 | 5.71,2.55 5.71,2.45 | 5.71,2.72 5.71,2.55 | U2.PG5 5.74,2.52 5.71,2.55 | U2.PG4 5.71,3.02 | 4.7,2.52 U2.PG1 | 4.7,2.52 5.64,2.52 5.71,2.45 | U2.P11 4.71,2.51 4.7,2.52 | 23.67,17.19 23.66,17.2
  Bottom 0.3: U2.P3 5.21,3.02
  other vias: 23.93,15.58 3.3,14.16 3.3,14.76 2.7,14.16 2.7,14.76 27.57,11.3 29.5,11 26.74,12.44 6.53,9 7.73,12.53 19.35,0.98 22.5,1.54 14.25,19.01 13.65,19.01 14.25,18.41 13.65,18.41 14.85,19.01 14.85,18.41 30.49,3.5 30.49,4.1 29.89,3.5 29.89,4.1 30.49,2.9 29.89,2.9 30.89,7.82 30.89,8.42 30.29,7.82 30.29,8.42 19.02,9.8 19.02,10.4 18.42,9.8 18.42,10.4 17.23,12.39 17.23,12.99 16.63,12.39 16.63,12.99 23.21,5.89 22.43,6.78 28.52,1.2 30.84,15.24 1.36,0.93 0.75,2.3 1.05,8.54 3.8,10.01 5.12,10.01 6.71,11.4 6.17,14.76 5.57,14.76 6.17,14.16 5.57,14.16 6.77,14.76 6.77,14.16 16.89,14.09 23.92,16.24 23.92,16.88 25.86,16.06 2.73,11.3 2.73,12.12 26.81,5.02 9.37,5.96 9.77,6.86 9.77,7.86 10.97,5.41
  pour Top (rank 6): 0,0 32,0 32,20 0,20
  pour Bottom (rank 6): 0,0 32,0 32,20 0,20
I2C1_SCL  (via drill 0.2 pad 0.45)
  Top 0.2: v26.25,9.7 v25.06,9.7 25.06,8.77 26.3,7.52 v26.46,7.52
  Bottom 0.2: U5.P2 29.88,12.24 30.22,11.9 30.22,10.47 29.45,9.7 v26.25,9.7 | U4.P2 27.53,5.79 27.36,5.62 26.89,5.62 26.68,5.83 26.68,7.3 v26.46,7.52 | v25.06,9.7 MCU1.P58
I2C1_SDA  (via drill 0.2 pad 0.45)
  Top 0.2: v25.66,8.91 25.99,8.91 v26.87,8.03
  Bottom 0.2: MCU1.P59 24.06,9.17 25.33,9.17 25.36,9.21 | U5.P4 28.75,10.85 28.12,10.23 25.89,10.23 25.71,10.05 25.71,9.55 25.36,9.21 | v25.66,8.91 25.36,9.21 | U4.P4 27.53,8.02 27.39,8.16 27,8.16 v26.87,8.03
I2C2_SCL  (via drill 0.2 pad 0.45)
  Top 0.2: v13.95,16.97 13.56,16.97 8.87,12.28 v8.65,12.28
  Bottom 0.2: MCU1.P34 15.03,16.87 14.8,17.1 14.08,17.1 v13.95,16.97 | U1.P7 v8.65,12.28
I2C2_SDA  (via drill 0.2 pad 0.45)
  Top 0.2: v15.6,15.17 v15.59,15.16 12.88,15.16 9.44,11.71 v9.44,11.53
  Bottom 0.2: U1.P8 9.15,11.24 v9.44,11.53 | MCU1.P35 15.53,15.24 v15.6,15.17
I2C3_SCL  (via drill 0.2 pad 0.45)
  Top 0.2: v18.9,1.49 18.9,3.5 v18.74,3.66
  Bottom 0.2: CN4.P$8 14.43,0.82 18.23,0.82 v18.9,1.49 | MCU1.P8 18.53,3.87 v18.74,3.66
I2C3_SDA  (via drill 0.2 pad 0.45)
  Top 0.2: CN4.P$10 16.96,3.67 v18,3.67
  Bottom 0.2: v18,3.67 18.03,3.7 MCU1.P9
INT_ACC  (via drill 0.2 pad 0.45)
  Top 0.2: v19,8.2 19.58,8.2 21.37,6.41 21.37,5.83 v23.32,3.88
  Bottom 0.2: v19,8.2 16.42,8.2 15.53,7.31 MCU1.P14 | U3.P4 23.69,3.47 23.32,3.84 v23.32,3.88
LED_B  (via drill 0.2 pad 0.45)
  Top 0.2: v11.5,11.71 10.89,11.71 7.45,8.27 R5.P$2
  Bottom 0.2: MCU1.P27 11.52,11.7 v11.5,11.71
LED_G  (via drill 0.2 pad 0.45)
  Top 0.2: R7.P$2 9,8.67 10.98,10.65 v11.5,10.65
  Bottom 0.2: v11.5,10.65 12.48,10.65 MCU1.P25
LED_R  (via drill 0.2 pad 0.45)
  Top 0.2: R6.P$2 8.2,8.44 10.94,11.18 v11.11,11.18
  Bottom 0.2: MCU1.P26 12.52,11.18 v11.11,11.18
LOAD_EN  (via drill 0.2 pad 0.45)
  Top 0.2: v5.46,4.39 6.78,4.39 7.62,5.22 9.72,5.22 v9.91,5.41
  Bottom 0.2: U2.P4 5.71,4.14 v5.46,4.39 | v9.91,5.41 10.33,5.83 10.33,9.17 11.28,10.12 11.78,10.12 11.81,10.15 12.48,10.15 MCU1.P24
N$1
  pour Bottom (no thermals): 4.64,3.52 4.78,3.52 4.78,4.75 4.9,4.9 4.9,6.77 4.2,6.77 4.2,4.9 4.64,4.48
N$2  (via drill 0.2 pad 0.45)
  Top 0.2: R1.P$1 8.23,1.35 v7.5,1.35
  Bottom 0.2: v7.5,1.35 6.85,1.35 6.71,1.49 U2.P7
N$3
  Top 0.2: LED1.P$4 R5.P$1
N$4
  Top 0.2: 8.1,6.75 R6.P$1 7.46,6.85 6.97,6.37 LED1.P$5
N$5
  Top 0.2: R7.P$1 9,6.5 8.8,6.3 7.48,6.3 6.83,5.64 LED1.P$6
N$6
  Bottom 0.2: R2.P$2 U8.5
NRST  (via drill 0.2 pad 0.45)
  Top 0.2: CN1.P$4 26.69,15.55 26.41,15.27 24.87,15.27 24.07,14.47 22.7,14.47 22.45,14.22 22.45,12.91 21.04,11.5 v21.04,10.68
  Bottom 0.2: v21.04,10.68 21.04,7.38 19.03,5.37 MCU1.P7
RCC_LSE_IN
  Bottom 0.2: MCU1.P3 21.03,4.03 21.5,3.55 X1.P1 21.28,2.98 C1.P$1
RCC_LSE_OUT
  Bottom 0.2: MCU1.P4 20.53,4.03 20.05,3.55 X1.P2 20.28,2.98 C2.P$1
SDMMC_CD  (via drill 0.2 pad 0.45)
  Top 0.2: v15.22,7.75 16.27,7.75 CN3.P$5
  Bottom 0.2: v15.22,7.75 15.03,7.56 MCU1.P15
SDMMC_CLK  (via drill 0.2 pad 0.45)
  Top 0.2: CN3.P$11 25.98,5.65 21.57,10.06 21.57,11.44 22.34,12.2 v22.99,12.2
  Bottom 0.2: MCU1.P53 v22.99,12.2
SDMMC_CMD  (via drill 0.2 pad 0.45)
  Top 0.2: CN3.P$9 27.58,7.85 26.72,6.99 26.24,6.99 22.99,10.24 v22.99,11.51
  Bottom 0.2: MCU1.P54 23.18,11.7 v22.99,11.51
SDMMC_D0  (via drill 0.2 pad 0.45)
  Top 0.2: CN3.P$13 27.75,3.75 27.22,3.75 20.5,10.46 20.5,11.76 18.6,13.66 18.6,13.67 18.29,13.98 18.28,13.98 v18.09,14.17
  Bottom 0.2: MCU1.P39 17.53,15.45 18.09,14.89 v18.09,14.17
SDMMC_D1  (via drill 0.2 pad 0.45)
  Top 0.2: CN3.P$14 27.75,2.65 27.28,2.65 27,2.93 27,3.4 20.1,10.3 20.1,11.4 18.09,13.41 v18.09,13.42
  Bottom 0.2: MCU1.P40 18.03,15.52 18.63,14.92 18.63,13.96 v18.09,13.42
SDMMC_D2  (via drill 0.2 pad 0.45)
  Top 0.2: CN3.P$7 27.79,10.25 27.06,10.25 26.23,11.08 26.23,11.52 26.24,11.53 26.24,12.08 v25.93,12.39
  Bottom 0.2: MCU1.P51 25.1,13.2 25.38,12.93 25.4,12.93 v25.93,12.39
SDMMC_D3  (via drill 0.2 pad 0.45)
  Top 0.2: CN3.P$8 28,8.84 27.04,8.84 26.93,8.95 26.93,9.79 25.83,10.89 25.83,11.44 25.83,11.72 v25.19,12.37
  Bottom 0.2: v25.19,12.37 24.86,12.7 MCU1.P52
SPI1_CS  (via drill 0.2 pad 0.45)
  Top 0.2: U6.P$10 12.77,13.19 11.95,12.37 v11.5,12.37
  Bottom 0.2: v11.5,12.37 11.63,12.24 12.49,12.24 MCU1.P28
SPI1_IRQ  (via drill 0.2 pad 0.45)
  Top 0.2: U6.P$4 0.51,10.66 2.03,10.66 3.19,9.5 3.19,7.01 3.89,6.3 3.89,5.2 5.23,3.86 6.82,3.86 7.78,4.82 12.26,4.82 13.17,5.73 v14.48,5.73
  Bottom 0.2: v14.48,5.73 14.48,4.75 MCU1.P16
SPI1_MISO  (via drill 0.2 pad 0.45)
  Top 0.2: U6.P$8 13.3,10.65 11.59,8.93 v11.5,8.93
  Bottom 0.2: MCU1.P22 12.48,9.15 11.81,9.15 11.59,8.93 v11.5,8.93
SPI1_MOSI  (via drill 0.2 pad 0.45)
  Top 0.2: U6.P$9 13.98,11.92 11.65,9.59 v11.5,9.59
  Bottom 0.2: MCU1.P23 11.61,9.7 v11.5,9.59
SPI1_RST  (via drill 0.2 pad 0.45)
  Top 0.2: U6.P$11 12.93,14.46 v11.5,13.03
  Bottom 0.2: MCU1.P30 11.67,13.2 v11.5,13.03
SPI1_SCK  (via drill 0.2 pad 0.45)
  Top 0.2: U6.P$7 14.5,9.26 v13.79,8.55
  Bottom 0.2: v13.79,8.55 13.53,8.55 13.38,8.7 MCU1.P21
SPI2_CS  (via drill 0.2 pad 0.45)
  Top 0.2: v25.91,1.11 25.91,1.2 23.85,3.26 23.85,4.1 v21.9,6.05
  Bottom 0.2: v25.91,1.11 25.8,1.22 25.8,1.75 U3.P12 | MCU1.P2 21.53,5.68 v21.9,6.05
SPI2_MISO  (via drill 0.2 pad 0.45)
  Top 0.2: v23.83,1.07 19.17,5.73 v18.64,5.73 18.45,5.73 15.61,2.89 CN4.P$9
  Bottom 0.2: v18.64,5.73 17.88,5.73 17.53,5.38 MCU1.P10 | U3.P1 23.67,1.97 23.54,1.84 23.54,1.36 v23.83,1.07
SPI2_MOSI  (via drill 0.2 pad 0.45)
  Top 0.2: CN4.P$7 14.43,3.69 15.84,3.69 18.41,6.26 v19.17,6.26 19.44,6.26 v24.59,1.11
  Bottom 0.2: v19.17,6.26 17.84,6.26 17.03,5.45 MCU1.P11 | U3.P14 24.7,1.75 24.7,1.22 v24.59,1.11
SPI2_SCK  (via drill 0.2 pad 0.45)
  Top 0.2: v25.25,1.11 25.25,1.2 20.97,5.48 20.97,6.24 19.91,7.3 18.16,7.3 | v13.15,4.96 15.82,4.96 18.16,7.3 | 18.16,7.3 v18.16,8.73 v18.16,8.74
  Bottom 0.2: U3.P13 v25.25,1.11 | CN4.P$5 12.36,4.17 v13.15,4.96 | v18.16,8.74 16.24,10.66 16.24,11.59 15.92,11.91 14.01,11.91 13.22,12.7 MCU1.P29
USART1_RX  (via drill 0.2 pad 0.45)
  Top 0.2: CN1.P$6 27.96,16.25 26.58,14.87 25.04,14.87 23.7,13.53 v22.99,13.53
  Bottom 0.2: MCU1.P43 19.53,13.65 20.15,13.03 21.76,13.03 22.22,13.5 22.25,13.53 v22.99,13.53
USART1_TX  (via drill 0.2 pad 0.45)
  Top 0.2: v23,12.87 23.61,12.87 25.2,14.47 26.75,14.47 29.23,16.95 CN1.P$8
  Bottom 0.2: MCU1.P42 19.03,13.59 19.99,12.63 22.02,12.63 22.25,12.87 v23,12.87
USB_DM  (via drill 0.2 pad 0.45)
  Top 0.2: 20.68,15.03 20.68,14.63 U7.P3 | U7.P4 20.68,15.03 | 20.68,15.03 20.68,16.02 20.63,16.07 CN2.P2 20.6,16.93 v20.3,17.23
  Bottom 0.2: MCU1.P44 20.03,16.95 v20.3,17.22 v20.3,17.23
USB_DP  (via drill 0.2 pad 0.45)
  Top 0.2: 19.88,15.03 19.88,14.63 U7.P2 19.78,13.98 20.2,13.56 v20.4,13.56 | 19.88,15.03 U7.P1 | 19.88,15.03 19.88,16.02 19.91,16.05 19.94,16.05 CN2.P3
  Bottom 0.2: v20.4,13.56 20.53,13.69 MCU1.P45
VBAT  (via drill 0.2 pad 0.45)
  Top 0.3: CN4.P$4 10.22,0.75 6.42,0.75 v6.25,0.92 v5.16,0.92 2.54,0.92 v1.64,1.82
  Top 0.4: X2.1 C9.P$1 v1.64,1.82
  Bottom 0.15: v6.25,0.92 6.25,1.78 U2.P8
  Bottom 0.152: v5.16,0.92 5.16,1.77 U2.P10
  Bottom 0.2: U1.P2 8.7,8.74 8.7,7.34 8.48,7.12 8.15,7.12 | 8.15,7.12 3.47,7.12 | 3.42,7.12 3.37,7.07 | U1.P3 8.15,7.12
  Bottom 0.3: R3.P$1 v1.64,1.82
  Bottom 0.4: 3.37,7.47 3.37,7.07 | X2.1 3.47,3.94 3.47,7.12
  pour Bottom (no thermals): 1.25,4.39 1.25,3.48 4.28,3.48 4.28,3.92 3.97,3.92 3.28,4.65 2.69,4.65 2.43,4.39
  pour Bottom (no thermals): 3.55,9.11 4.05,9.11 4.05,7.07 3.2,7.07 2.73,7.54 2.73,9.01 3.13,9.01 3.13,8.16 3.38,7.91 3.42,7.91 3.55,8.04
VCC  (via drill 0.2 pad 0.45)
  Top 0.2: v7.5,3.79 7.17,3.46 5.06,3.46 3.49,5.03 3.49,6.14 2.76,6.87 2.76,8.53 1.91,9.38 U6.P$5 0.66,9.38 0.45,9.17 C14.P$1 C15.P$1 | 27.89,6.59 CN3.P$10
  Top 0.3: v7.5,3.79 8.08,4.37 15.87,4.37 18.34,6.84 19.63,6.84 v20.44,6.02 | 27.89,6.59 27.84,6.54 25.88,6.54 v22.1,10.32
  Bottom 0.2: v7.5,3.79 6.78,3.79 U2.P6
  Bottom 0.3: v20.44,6.02 21.49,7.07 21.49,9.71 v22.1,10.32
VDD  (via drill 0.2 pad 0.45)
  Top 0.2: v26.76,11.3 27.3,10.75 28.92,10.75 29.5,10.17 v29.5,9.17 v29.5,6.91 | v15.73,13.56 15.71,13.54 v15.71,11.38
  Top 0.4: CN4.P$2 9.45,1.99 9.07,2.37 R1.P$2 | R1.P$2 v8.25,3.72 8.32,3.79 v13.26,3.79 | C10.P$1 R1.P$2
  Bottom 0.152: MCU1.P19 C6.P$1
  Bottom 0.2: C4.P$1 MCU1.P48 22.03,18.99 22.74,19.7 28,19.7 28.05,19.65 | MCU1.P64 C5.P$1 24.03,4.57 24.08,4.52 | C8.P$1 C3.P$1 12.51,14.22 MCU1.P32 13.98,14.2 14.63,13.56 v15.73,13.56 | C18.P$1 C17.P$1 15.86,3.61 15.68,3.79 | 13.79,7.71 MCU1.P19 | U3.P3 23.13,2.97 | 23.13,2.97 23.13,2.47 | 23.13,2.47 23.13,0.35 | U3.P2 23.13,2.47 | 22.79,4.52 22.61,4.7 MCU1.P1 | 24.08,4.52 22.79,4.52 | 24.08,4.52 24.42,4.52 24.75,4.19 U3.P5 | 30.62,12.75 30.62,13.18 29.91,13.89 C11.P$1 29.25,13.7 U5.P10 | 30.62,12.75 30.62,10.3 29.5,9.18 v29.5,9.17 | U5.P1 30.61,12.74 30.62,12.75 | U4.P1 28.33,5.8 28.45,5.68 29,5.68 C13.P$1 v29.5,6.91 U4.P6 | U5.P6 27.49,12.24 26.76,11.51 v26.76,11.3 | MCU1.P13 16.03,4.03 15.79,3.79 15.68,3.79 | v13.26,3.79 15.68,3.79 | 13.79,7.75 15.71,9.67 v15.71,11.38 | U3.P8 27.29,3.47 C12.P$1 27.32,0.36 27.33,0.35 | 23.13,2.97 22.79,3.31 22.79,4.52
  Bottom 0.3: 31.65,6.91 31.65,19.3 31.3,19.65 28.05,19.65 27.96,19.65 CN1.P$5 | 31.65,6.91 v29.5,6.91 | 31.65,6.91 31.65,0.72 31.28,0.35 27.33,0.35 23.13,0.35 11.09,0.35 CN4.P$2
  Bottom 0.4: L1.P$2 7.05,5.92 8.25,4.72 v8.25,3.72 | 13.79,7.75 13.79,7.71 13.79,4.31 13.27,3.79 v13.26,3.79
  pour Bottom (no thermals): 6.14,3.52 6.28,3.52 6.28,4.67 6.5,4.9 6.5,6.77 5.8,6.77 5.8,4.9 6.14,4.51
VUSB  (via drill 0.2 pad 0.45)
  Top 0.2: v21.04,17.23 21.04,17.15
  Top 0.3: 21.04,17.15 21.26,16.93 CN2.P1
  Bottom 0.3: v21.04,17.23 21.04,17.31 20.54,17.81 20.06,17.81 19.81,17.55 11.99,17.55 10.91,16.47 10.91,14.54 9.82,13.45 3.9,13.45 3.8,13.35 C7.P$1 U8.4

### Text on the board
bNames: X | Y
DrillLegend: LAYER-STACK
DrillLegend_01-16: 01-16
201bmp: C:/Users/andre/Downloads/sigillo-bianco (3).bmp